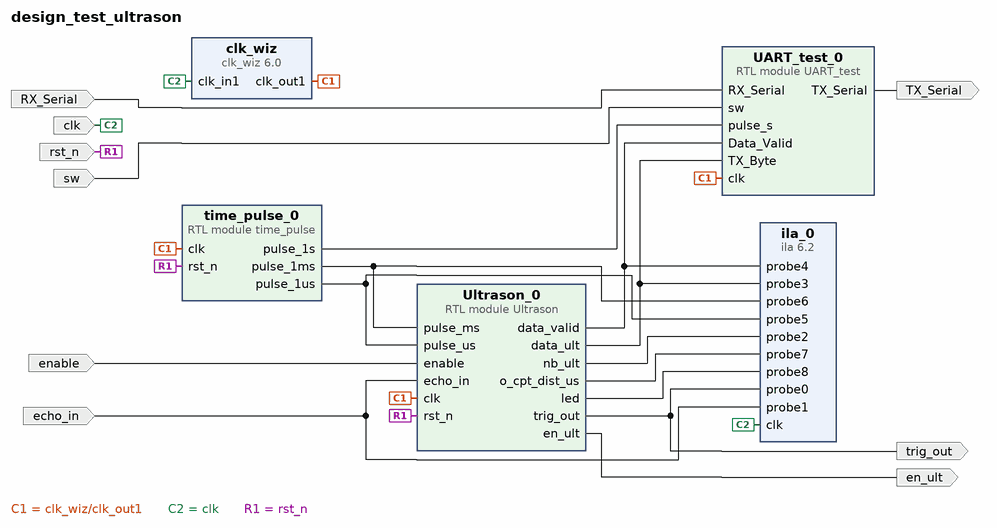
[diagram p0: block diagram of the top level]
# Vivado block design design_test_ultrason, xc7z020clg400-1, Vivado 2020.2
create_bd_design design_test_ultrason

create_bd_port -dir I -type clk clk
set_property -dict {CONFIG.FREQ_HZ 125000000 CONFIG.PHASE 0.000} [get_bd_ports clk]
create_bd_port -dir I -type rst rst_n
create_bd_port -dir I enable
create_bd_port -dir O trig_out
create_bd_port -dir I echo_in
create_bd_port -dir I RX_Serial
create_bd_port -dir O TX_Serial
create_bd_port -dir I sw
create_bd_port -dir O en_ult

create_bd_cell -type ip -vlnv xilinx.com:ip:clk_wiz:6.0 clk_wiz
set_property -dict [list \
  CONFIG.CLKIN1_JITTER_PS 80.0 \
  CONFIG.CLKOUT1_JITTER 143.688 \
  CONFIG.CLKOUT1_PHASE_ERROR 96.948 \
  CONFIG.CLKOUT1_REQUESTED_OUT_FREQ 50 \
  CONFIG.CLKOUT1_USED true \
  CONFIG.CLK_IN1_BOARD_INTERFACE sys_clock \
  CONFIG.MMCM_CLKFBOUT_MULT_F 8.000 \
  CONFIG.MMCM_CLKIN1_PERIOD 8.000 \
  CONFIG.MMCM_CLKIN2_PERIOD 10.000 \
  CONFIG.MMCM_CLKOUT0_DIVIDE_F 20.000 \
  CONFIG.USE_BOARD_FLOW true \
  CONFIG.USE_LOCKED false \
  CONFIG.USE_RESET false \
] [get_bd_cells clk_wiz]
create_bd_cell -type module -reference time_pulse time_pulse_0
create_bd_cell -type ip -vlnv xilinx.com:ip:ila:6.2 ila_0
set_property -dict [list \
  CONFIG.C_DATA_DEPTH 65536 \
  CONFIG.C_ENABLE_ILA_AXI_MON false \
  CONFIG.C_MONITOR_TYPE Native \
  CONFIG.C_NUM_OF_PROBES 9 \
  CONFIG.C_PROBE2_WIDTH 3 \
  CONFIG.C_PROBE3_WIDTH 16 \
  CONFIG.C_PROBE7_WIDTH 13 \
  CONFIG.C_PROBE8_WIDTH 3 \
] [get_bd_cells ila_0]
create_bd_cell -type module -reference Ultrason Ultrason_0
create_bd_cell -type module -reference UART_test UART_test_0

# ---- connections ----

connect_bd_net [get_bd_pins clk_wiz/clk_out1] [get_bd_pins time_pulse_0/clk] [get_bd_pins Ultrason_0/clk] [get_bd_pins UART_test_0/clk]
connect_bd_net -net sys_clock_1 [get_bd_ports clk] [get_bd_pins clk_wiz/clk_in1] [get_bd_pins ila_0/clk]
connect_bd_net -net rst_n_0_1 [get_bd_ports rst_n] [get_bd_pins time_pulse_0/rst_n] [get_bd_pins Ultrason_0/rst_n]
connect_bd_net -net enable_0_1 [get_bd_ports enable] [get_bd_pins Ultrason_0/enable]
connect_bd_net [get_bd_pins time_pulse_0/pulse_1ms] [get_bd_pins ila_0/probe6] [get_bd_pins Ultrason_0/pulse_ms]
connect_bd_net [get_bd_pins time_pulse_0/pulse_1us] [get_bd_pins ila_0/probe5] [get_bd_pins Ultrason_0/pulse_us]
connect_bd_net [get_bd_pins Ultrason_0/trig_out] [get_bd_ports trig_out] [get_bd_pins ila_0/probe0]
connect_bd_net -net echo_in_0_1 [get_bd_ports echo_in] [get_bd_pins ila_0/probe1] [get_bd_pins Ultrason_0/echo_in]
connect_bd_net -net RX_Serial_0_1 [get_bd_ports RX_Serial] [get_bd_pins UART_test_0/RX_Serial]
connect_bd_net [get_bd_pins UART_test_0/TX_Serial] [get_bd_ports TX_Serial]
connect_bd_net [get_bd_pins Ultrason_0/data_valid] [get_bd_pins ila_0/probe4] [get_bd_pins UART_test_0/Data_Valid]
connect_bd_net [get_bd_pins Ultrason_0/data_ult] [get_bd_pins ila_0/probe3] [get_bd_pins UART_test_0/TX_Byte]
connect_bd_net -net sw_0_1 [get_bd_ports sw] [get_bd_pins UART_test_0/sw]
connect_bd_net [get_bd_pins Ultrason_0/en_ult] [get_bd_ports en_ult]
connect_bd_net [get_bd_pins Ultrason_0/nb_ult] [get_bd_pins ila_0/probe2]
connect_bd_net [get_bd_pins Ultrason_0/o_cpt_dist_us] [get_bd_pins ila_0/probe7]
connect_bd_net [get_bd_pins Ultrason_0/led] [get_bd_pins ila_0/probe8]
connect_bd_net [get_bd_pins time_pulse_0/pulse_1s] [get_bd_pins UART_test_0/pulse_s]

validate_bd_design
save_bd_design
